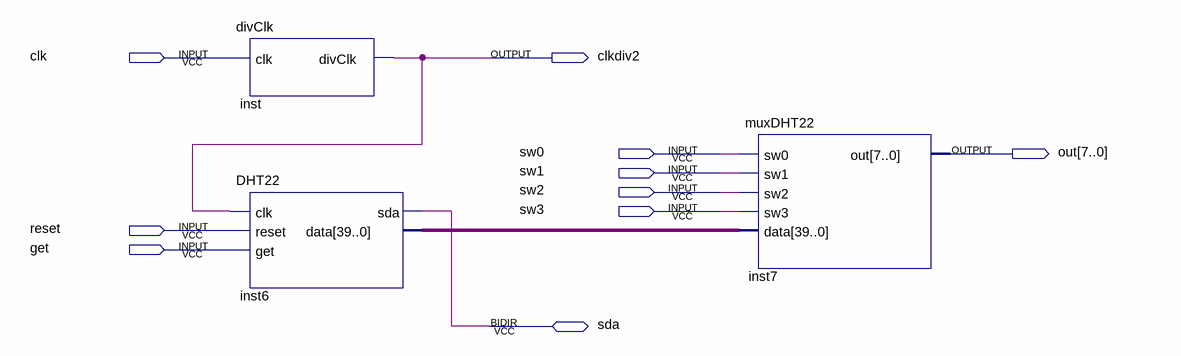
[diagram p0: schematic sheet]
// Quartus schematic DHT22_SWITCH.bdf as structural Verilog: 3 symbols, 10 pins
module DHT22_SWITCH (
  input  clk,
  input  sw0,
  input  sw1,
  input  sw2,
  input  sw3,
  input  reset,
  input  get,
  inout  sda,
  output clkdiv2,
  output [7:0] out
);

  wire [39:0] inst6_data;

  divClk inst (.clk(clk), .divClk(clkdiv2));
  DHT22 inst6 (.clk(clkdiv2), .reset(reset), .get(get), .data(inst6_data), .sda(sda));
  muxDHT22 inst7 (.sw0(sw0), .sw1(sw1), .sw2(sw2), .sw3(sw3), .data(inst6_data), .out(out));
endmodule
